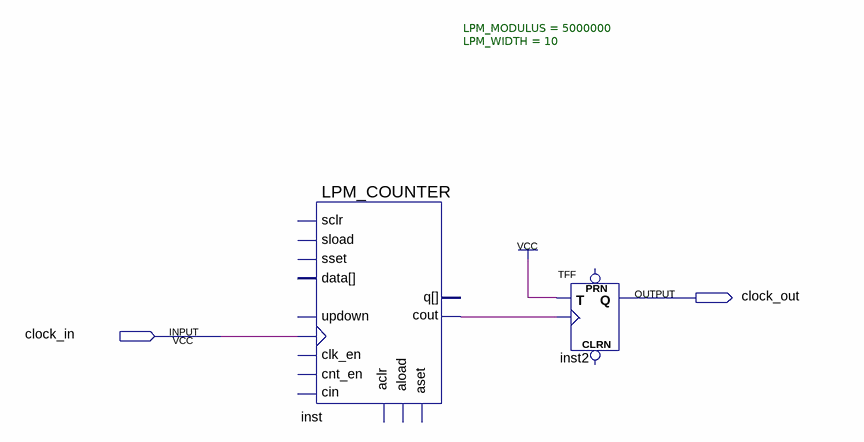
[diagram p0: schematic sheet]
// Quartus schematic Divisor_de_clock2.bdf as structural Verilog: 2 symbols, 2 pins
module Divisor_de_clock2 (
  input  clock_in,
  output clock_out
);

  wire inst_cout;

  LPM_COUNTER #(.LPM_MODULUS(5000000), .LPM_WIDTH(10)) inst (
    .clock(clock_in), .cout(inst_cout));  // open: sload, data, clk_en, aload, aclr, aset, cin, sset, updown, cnt_en, sclr, q
  TFF inst2 (.T(1'b1), .CLK(inst_cout), .Q(clock_out));  // open: PRN, CLRN
endmodule
